# Altium schematic sheet CAN_bus_powered.SchDoc
size A4; SheetNumber: 5; SheetTotal: 8
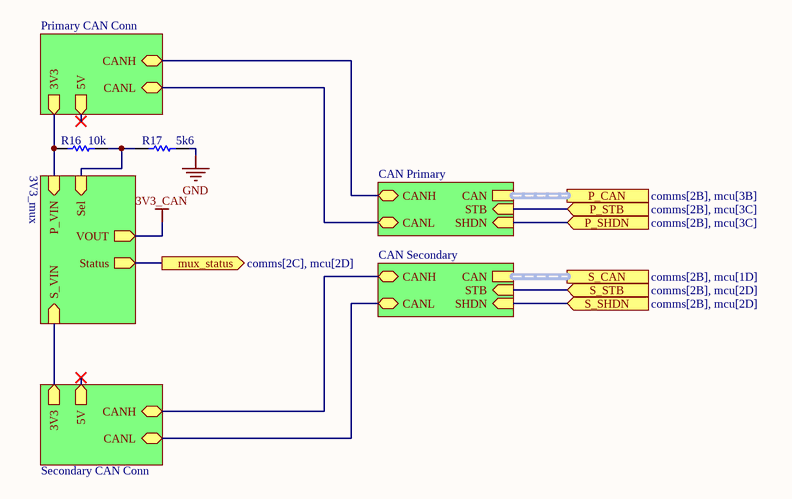
[diagram p0: CAN_bus_powered.SchDoc]

## Parts
R16  10k
R17  5k6

## Sub-sheets
3V3_mux = power_mux: P_VIN (in), S_VIN (in), Sel (in), VOUT (out), Status (out)
CAN Primary = CAN_transciever: CAN (harness CAN), STB (in), SHDN (in), CANH (bidir), CANL (bidir)
CAN Secondary = CAN_transciever: CAN (harness CAN), STB (in), SHDN (in), CANH (bidir), CANL (bidir)
Primary CAN Conn = dual_CAN_conn: 5V (out), 3V3 (out), CANH (bidir), CANL (bidir)
Secondary CAN Conn = dual_CAN_conn: 5V (out), 3V3 (out), CANH (bidir), CANL (bidir)

## Ports
mux_status (out, see comms[2C], mcu[2D]), P_CAN (harness CAN, see comms[2B], mcu[3B]), P_SHDN (in, see comms[2B], mcu[3C]), P_STB (in, see comms[2B], mcu[3C]), S_CAN (harness CAN, see comms[2B], mcu[1D]), S_SHDN (in, see comms[2B], mcu[2D]), S_STB (in, see comms[2B], mcu[2D])

## Nets
3V3_CAN: sheet 3V3_mux/VOUT
GND: R17.1
mux_status: port mux_status, sheet 3V3_mux/Status
P_SHDN: port P_SHDN, sheet CAN Primary/SHDN
P_STB: port P_STB, sheet CAN Primary/STB
S_SHDN: port S_SHDN, sheet CAN Secondary/SHDN
S_STB: port S_STB, sheet CAN Secondary/STB
NetR16_1: R16.1 R17.2 ; sheet 3V3_mux/Sel
NetR16_2: R16.2 ; sheet Primary CAN Conn/3V3, sheet 3V3_mux/P_VIN
(unnamed): sheet CAN Primary/CANH, sheet Primary CAN Conn/CANH
(unnamed): sheet CAN Primary/CANL, sheet Primary CAN Conn/CANL
(unnamed): sheet CAN Secondary/CANH, sheet Secondary CAN Conn/CANH
(unnamed): sheet CAN Secondary/CANL, sheet Secondary CAN Conn/CANL
(unnamed): sheet Secondary CAN Conn/3V3, sheet 3V3_mux/S_VIN

## Buses and harness runs
harness port P_CAN = sheet CAN Primary/CAN
harness port S_CAN = sheet CAN Secondary/CAN

## Library data of the parts
R16 R17 = Resistor